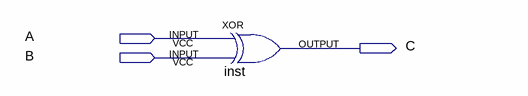
[diagram p0: schematic sheet]
// Quartus schematic XOR_VHDL.bdf as structural Verilog: 1 symbols, 3 pins
module XOR_VHDL (
  input  A,
  input  B,
  output C
);

  xor inst (C, A, B);
endmodule
